# Altium schematic sheet Sheet1.SchDoc
size A3
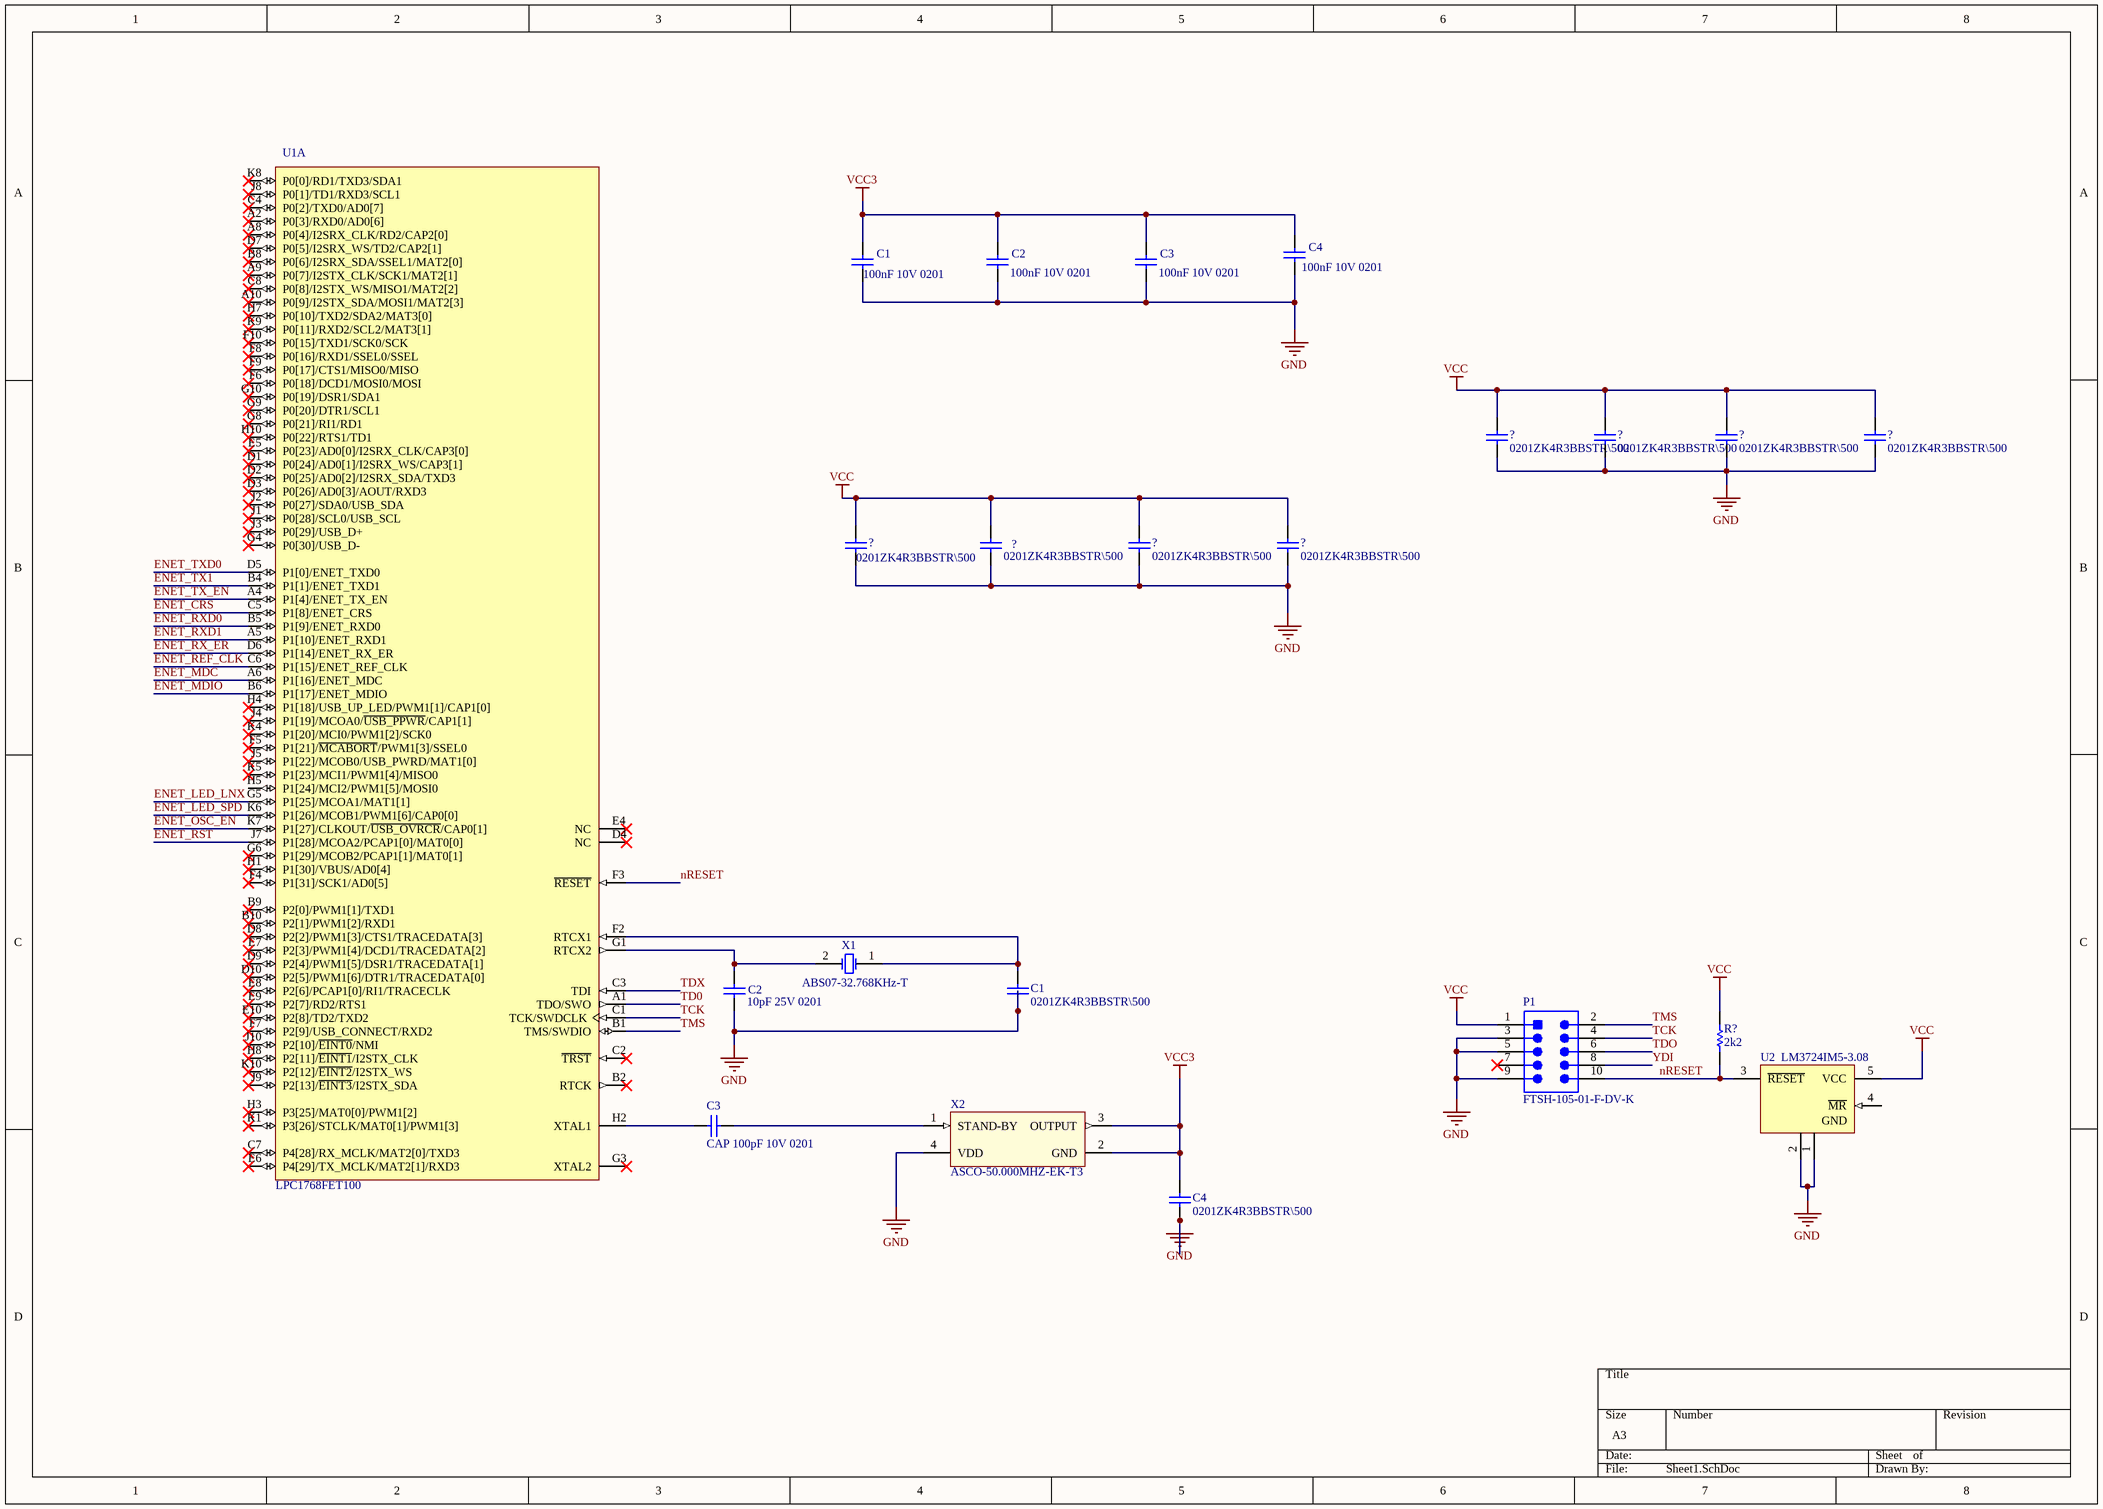
[diagram p0: Sheet1.SchDoc]

## Parts
(Parts that share a designator on the sheet are numbered #1, #2 ... from top to bottom, then left to right.)
?#1  0201ZK4R3BBSTR\500  [CAPC0603X28X15LL05T05]
?#2  0201ZK4R3BBSTR\500  [CAPC0603X28X15LL05T05]
?#3  0201ZK4R3BBSTR\500  [CAPC0603X28X15LL05T05]
?#4  0201ZK4R3BBSTR\500  [CAPC0603X28X15LL05T05]
?#5  0201ZK4R3BBSTR\500  [CAPC0603X28X15LL05T05]
?#6  0201ZK4R3BBSTR\500  [CAPC0603X28X15LL05T05]
?#7  0201ZK4R3BBSTR\500  [CAPC0603X28X15LL05T05]
?#8  0201ZK4R3BBSTR\500  [CAPC0603X28X15LL05T05]
C1#1  100nF 10V 0201  [CAPC0603X28X15LL05T05]
C1#2  0201ZK4R3BBSTR\500  [CAPC0603X28X15LL05T05]
C2#1  100nF 10V 0201  [CAPC0603X28X15LL05T05]
C2#2  10pF 25V 0201  [CAPC0603X28X15LL05T05]
C3#1  100nF 10V 0201  [CAPC0603X28X15LL05T05]
C3#2  CAP 100pF 10V 0201  [CAPC0603X28X15LL05T05]
C4#1  100nF 10V 0201  [CAPC0603X28X15LL05T05]
C4#2  0201ZK4R3BBSTR\500  [CAPC0603X28X15LL05T05]
P1  FTSH-105-01-F-DV-K  [SMTC-FTSH-105-01-L-DV-K_V]
R?  2k2  [RESC0201(0603)_L]
U1  LPC1768FET100  [SOT926-1]  (part A of 2)
U2  LM3724IM5-3.08  [MF05A_N]
X1  ABS07-32.768KHz-T  [ABRA-ABS07-2_V]
X2  ASCO-50.000MHZ-EK-T3  [ABRA-ASCO-50.000MHZ-EK-T3-4_V]

## Nets
GND: ?#1.1 ?#2.1 ?#3.1 ?#4.1 ?#5.1 ?#6.1 ?#7.1 ?#8.1 C1#1.1 C1#2.1 C2#1.1 C2#2.1 C3#1.1 C4#1.1 C4#2.1 P1.3 P1.5 P1.9 U2.1(GND) U2.2(GND) X2.4(VDD)
VCC: ?#1.2 ?#2.2 ?#3.2 ?#4.2 ?#5.2 ?#6.2 ?#7.2 ?#8.2 P1.1 R?.1 U2.5(VCC)
VCC3: C1#1.2 C2#1.2 C3#1.2 C4#1.2 C4#2.2 X2.2(GND) X2.3(OUTPUT)
ENET_CRS: U1.C5(P1[8]/ENET_CRS)
ENET_LED_LNX: U1.G5(P1[25]/MCOA1/MAT1[1])
ENET_LED_SPD: U1.K6(P1[26]/MCOB1/PWM1[6]/CAP0[0])
ENET_MDC: U1.A6(P1[16]/ENET_MDC)
ENET_MDIO: U1.B6(P1[17]/ENET_MDIO)
ENET_OSC_EN: U1.K7(P1[27]/CLKOUT/~{USB_OVRCR}/CAP0[1])
ENET_REF_CLK: U1.C6(P1[15]/ENET_REF_CLK)
ENET_RST: U1.J7(P1[28]/MCOA2/PCAP1[0]/MAT0[0])
ENET_RX_ER: U1.D6(P1[14]/ENET_RX_ER)
ENET_RXD0: U1.B5(P1[9]/ENET_RXD0)
ENET_RXD1: U1.A5(P1[10]/ENET_RXD1)
ENET_TX1: U1.B4(P1[1]/ENET_TXD1)
ENET_TX_EN: U1.A4(P1[4]/ENET_TX_EN)
ENET_TXD0: U1.D5(P1[0]/ENET_TXD0)
nRESET: P1.10 R?.2 U1.F3(~{RESET}) U2.3(~{RESET})
TCK: P1.4 U1.C1(TCK/SWDCLK)
TD0: U1.A1(TDO/SWO)
TDO: P1.6
TDX: U1.C3(TDI)
TMS: P1.2 U1.B1(TMS/SWDIO)
YDI: P1.8
NetC1#2_2: C1#2.2 U1.F2(RTCX1) X1.1(X1)
NetC2#2_2: C2#2.2 U1.G1(RTCX2) X1.2(X2)
NetC3#2_1: C3#2.1 X2.1(STAND-BY)
NetC3#2_2: C3#2.2 U1.H2(XTAL1)

Not connected (* = marked no-connect by the designer): P1 7*; U1 A2(P0[3]/RXD0/AD0[6])* A8(P0[4]/I2SRX_CLK/RD2/CAP2[0])* A9(P0[7]/I2STX_CLK/SCK1/MAT2[1])* A10(P0[9]/I2STX_SDA/MOSI1/MAT2[3])* B2(RTCK)* B8(P0[6]/I2SRX_SDA/SSEL1/MAT2[0])* B9(P2[0]/PWM1[1]/TXD1)* B10(P2[1]/PWM1[2]/RXD1)* C2(~{TRST})* C4(P0[2]/TXD0/AD0[7])* C7(P4[28]/RX_MCLK/MAT2[0]/TXD3)* C8(P0[8]/I2STX_WS/MISO1/MAT2[2])* D1(P0[24]/AD0[1]/I2SRX_WS/CAP3[1])* D2(P0[25]/AD0[2]/I2SRX_SDA/TXD3)* D3(P0[26]/AD0[3]/AOUT/RXD3)* D4(NC)* D7(P0[5]/I2SRX_WS/TD2/CAP2[1])* D8(P2[2]/PWM1[3]/CTS1/TRACEDATA[3])* D9(P2[4]/PWM1[5]/DSR1/TRACEDATA[1])* D10(P2[5]/PWM1[6]/DTR1/TRACEDATA[0])* E4(NC)* E5(P0[23]/AD0[0]/I2SRX_CLK/CAP3[0])* E6(P4[29]/TX_MCLK/MAT2[1]/RXD3)* E7(P2[3]/PWM1[4]/DCD1/TRACEDATA[2])* E8(P2[6]/PCAP1[0]/RI1/TRACECLK)* E9(P2[7]/RD2/RTS1)* E10(P2[8]/TD2/TXD2)* F4(P1[31]/SCK1/AD0[5])* F5(P1[21]/~{MCABORT}/PWM1[3]/SSEL0)* F6(P0[18]/DCD1/MOSI0/MOSI)* F7(P2[9]/USB_CONNECT/RXD2)* F8(P0[16]/RXD1/SSEL0/SSEL)* F9(P0[17]/CTS1/MISO0/MISO)* F10(P0[15]/TXD1/SCK0/SCK)* G3(XTAL2)* G4(P0[30]/USB_D-)* G6(P1[29]/MCOB2/PCAP1[1]/MAT0[1])* G8(P0[21]/RI1/RD1)* G9(P0[20]/DTR1/SCL1)* G10(P0[19]/DSR1/SDA1)* H1(P1[30]/VBUS/AD0[4])* H3(P3[25]/MAT0[0]/PWM1[2])* H4(P1[18]/USB_UP_LED/PWM1[1]/CAP1[0])* H5(P1[24]/MCI2/PWM1[5]/MOSI0) H7(P0[10]/TXD2/SDA2/MAT3[0])* H8(P2[11]/~{EINT1}/I2STX_CLK)* H10(P0[22]/RTS1/TD1)* J1(P0[28]/SCL0/USB_SCL)* J2(P0[27]/SDA0/USB_SDA)* J3(P0[29]/USB_D+)* J4(P1[19]/MCOA0/~{USB_PPWR}/CAP1[1])* J5(P1[22]/MCOB0/USB_PWRD/MAT1[0])* J8(P0[1]/TD1/RXD3/SCL1)* J9(P2[13]/~{EINT3}/I2STX_SDA)* J10(P2[10]/~{EINT0}/NMI)* K1(P3[26]/STCLK/MAT0[1]/PWM1[3])* K4(P1[20]/MCI0/PWM1[2]/SCK0)* K5(P1[23]/MCI1/PWM1[4]/MISO0)* K8(P0[0]/RD1/TXD3/SDA1)* K9(P0[11]/RXD2/SCL2/MAT3[1])* K10(P2[12]/~{EINT2}/I2STX_WS)*; U2 4(~{MR})

## Library data of the parts
?#1-?#8 C1#2 C4#2 = CMP-2010-02256-1: C5; Manufacturer: AVX Interconnect / Elco; Part Number: 0201ZK4R3BBSTR\500
C1#1 C2#1 C2#2 C3#1 C3#2 C4#1 = CMP-2010-02256-1: C5; Manufacturer: AVX Interconnect / Elco; Part Number: 0201ZK4R3BBSTR\500
P1 = CMP-2000-05352-1: Male Header, Pitch 1.27 mm, 2 x 5 Position, Height 6.12 mm, RoHS, Tube; Manufacturer: Samtec; Number of Positions: 10; Connector Type: Header,Shrouded; Number of Positions Loaded: All; Row Spacing: 0.050"(1.27mm); Fastening Type: -; Package Reference: FTSH-105-01-L-DV-K; Termination: Solder; Package URL: http://suddendocs.samtec.com/prints/ftsh-1xx-xx-xxx-dv-xxx-footprint.pdf; Number of Rows: 2; Contact Finish Thickness: 3µin(0.08µm); Contact Type: MalePin; Manufacturer URL: http://www.samtec.com/; Contact Mating Length: 0.120"(3.05mm); Pitch: 0.050"(1.27mm); Series: FTSH; Features: -; Contact Finish: Gold; Color: Black; Family: RectangularConnectors-Headers,MalePins; Datasheet URL: http://suddendocs.samtec.com/prints/ftsh-1xx-xx-xxx-dv-xxx-mkt.pdf; Package Description: Male Header, Pitch 1.27 mm, 2 x 5 Position, Height 5.97 mm, Tail Length 4.32 mm; Mounting Type: SurfaceMount; Datasheet Version: Rev. ET, 10/1995; Category: Connectors,Interconnects; Packaging: Tube
R? = CMP-1591-00003-1: 0201 (0603 Metric) Chip Resistor; Case-Metric: 0603; Case-EIA: 0201; PackageReference: RESC0201(0603)
U1 = CMP-0174-00003-3: Cortex-M3, 32-Bit ARM MCU, 512 kB flash, 64 kB SRAM, Ethernet, USB 2.0 Device/Host/OTG, 12-Bit ADC, DAC, I2S, 100-Pin TFBGA; SPI: 1; VDD (max): 3.6 V; fmax: 100 MHz; PLL: Y; VDD (min): 2.4 V; VDD (typ): 3.3 V; Flash: 512 kB; SRAM: 64 kB; SSP: 2; ADC channels: 8; PWM: 6; GPIOs: 70; UART: 4; PartNumber: LPC1768FET100; ComponentLink2Description: Datasheet; ComponentLink1Description: Manufacturer URL; ComponentLink1URL: http://www.nxp.com/; PackageReference: SOT926-1; ComponentLink2URL: http://www.nxp.com/documents/data_sheet/LPC1769_68_67_66_65_64_63.pdf; USB: 1; DatasheetVersion: Rev. 8, Nov-2011; PackageDescription: TFBGA100: Plastic Thin Fine-Pitch Ball Grid Array Package; 100 Balls; Body 9 x 9 x 0.7 mm; CAN: 2; PackageVersion: 38708; Timers: 4
U2 = CMP-0063-01084-2: Microprocessor Reset Circuits, 5-pin SOT-23; Manufacturer: National Semiconductor; CompType: MiscPower; PackageTopMarking: R53B*XTT; PowerWise: N; ComponentLink2Description: LM3724 Web Page; RevisionNote: Component URLs added; DatasheetVersion: Jul-2007; PackageReference: MF05A; RoHS: N; PackageVersion: revD, Aug-2008; PackageDescription: Molded SOT-23, .115 x .063 x .040 in Body, 5 Lead, .0375 in Pitch; ComponentLink2URL: http://www.national.com/pf/LM/LM3724.html; ComponentLink3URL: http://www.national.com/packaging/folders/mf05a.html; ComponentLink1URL: http://www.national.com/ds/LM/LM3724.pdf; ComponentLink1Description: LM3724 Datasheet; PinCount: 5; ComponentLink3Description: MF05A Package Page
X1 = CMP-0447-00001-2: Crystal, 32.768 kHz, 12.5 pF, -40 to 85 degC, SMD Low Profile 3.2 x 1.5 x 0.9 mm, Tape and Reel; Manufacturer: Abracon; Q Value (Type): 30000; Operation Mode: Flexural Mode (Tuning Fork); Shunt Capacitance (C0): 0.9 to 1.2 pF; Load Capacitance (CL): 12.5 pF; Frequency Tolerance @+25degC: +/- 20 ppm; Drive Level (Type): 0.1 uW; Equivalent Series Resistance (R1): 70 Kohm; Insulation Resistance (Min): 500 Mohm; ComponentLink3URL: http://www.abracon.com/Resonators/ABS07.pdf; PackageDescription: 2-Pin Hand Drawn, Body 3.2x1.5mm, Pitch 2.5mm; Operating Temperature: -40 to 85 degC; ComponentLink2URL: http://www.abracon.com/Resonators/ABS07.pdf; PackageReference: ABS07-2; ComponentLink3Description: Package Specification; ComponentLink1Description: Manufacturer URL; DatasheetVersion: 04.03.13; Mounting Technology: Surface Mount; ComponentLink2Description: Datasheet; ComponentLink1URL: http://www.abracon.com/; PartNumber: ABS07-32.768KHz-T; Packing: Tape and Reel; Frequency: 32.768 kHz
X2 = CMP-0461-00001-3: Crystal Clock Oscillator, 50 MHz, -20 to 70 degC, 1.6 x 1.2 x 0.7 mm SMD; Manufacturer: Abracon; Frequency(MHz): 50; Aging: -3 to 3 3 ppm; Packing: Tape and Reel; Overall Frequency Stability: +/-30 ppm; Supply Current (Idd)
into 15pF Load: 6 mA; Supply Voltage (Vdd): 3.3 V; Output Load: 15 pF; ComponentLink2Description: Datasheet; ComponentLink3Description: Package Specification; ComponentLink3URL: http://www.abracon.com/Oscillators/ASCO.pdf; ComponentLink2URL: http://www.abracon.com/Oscillators/ASCO.pdf; Mounting Technology: Surface Mount; PackageDescription: 4-Pin Hand Drawn, Body 1.6 x 1.2 mm; DatasheetVersion: 01.25.13; ComponentLink1Description: Manufacturer URL; PartNumber: ASCO-50.000MHZ-EK-T3; Operating temperature: -20 to 70 degC; ComponentLink1URL: http://www.abracon.com; PackageReference: ASCO-50.000MHZ-EK-T3-4